# EAGLE schematic boardv2power (EAGLE 6.6.0)

## Sheet 1 of 4: Regulators
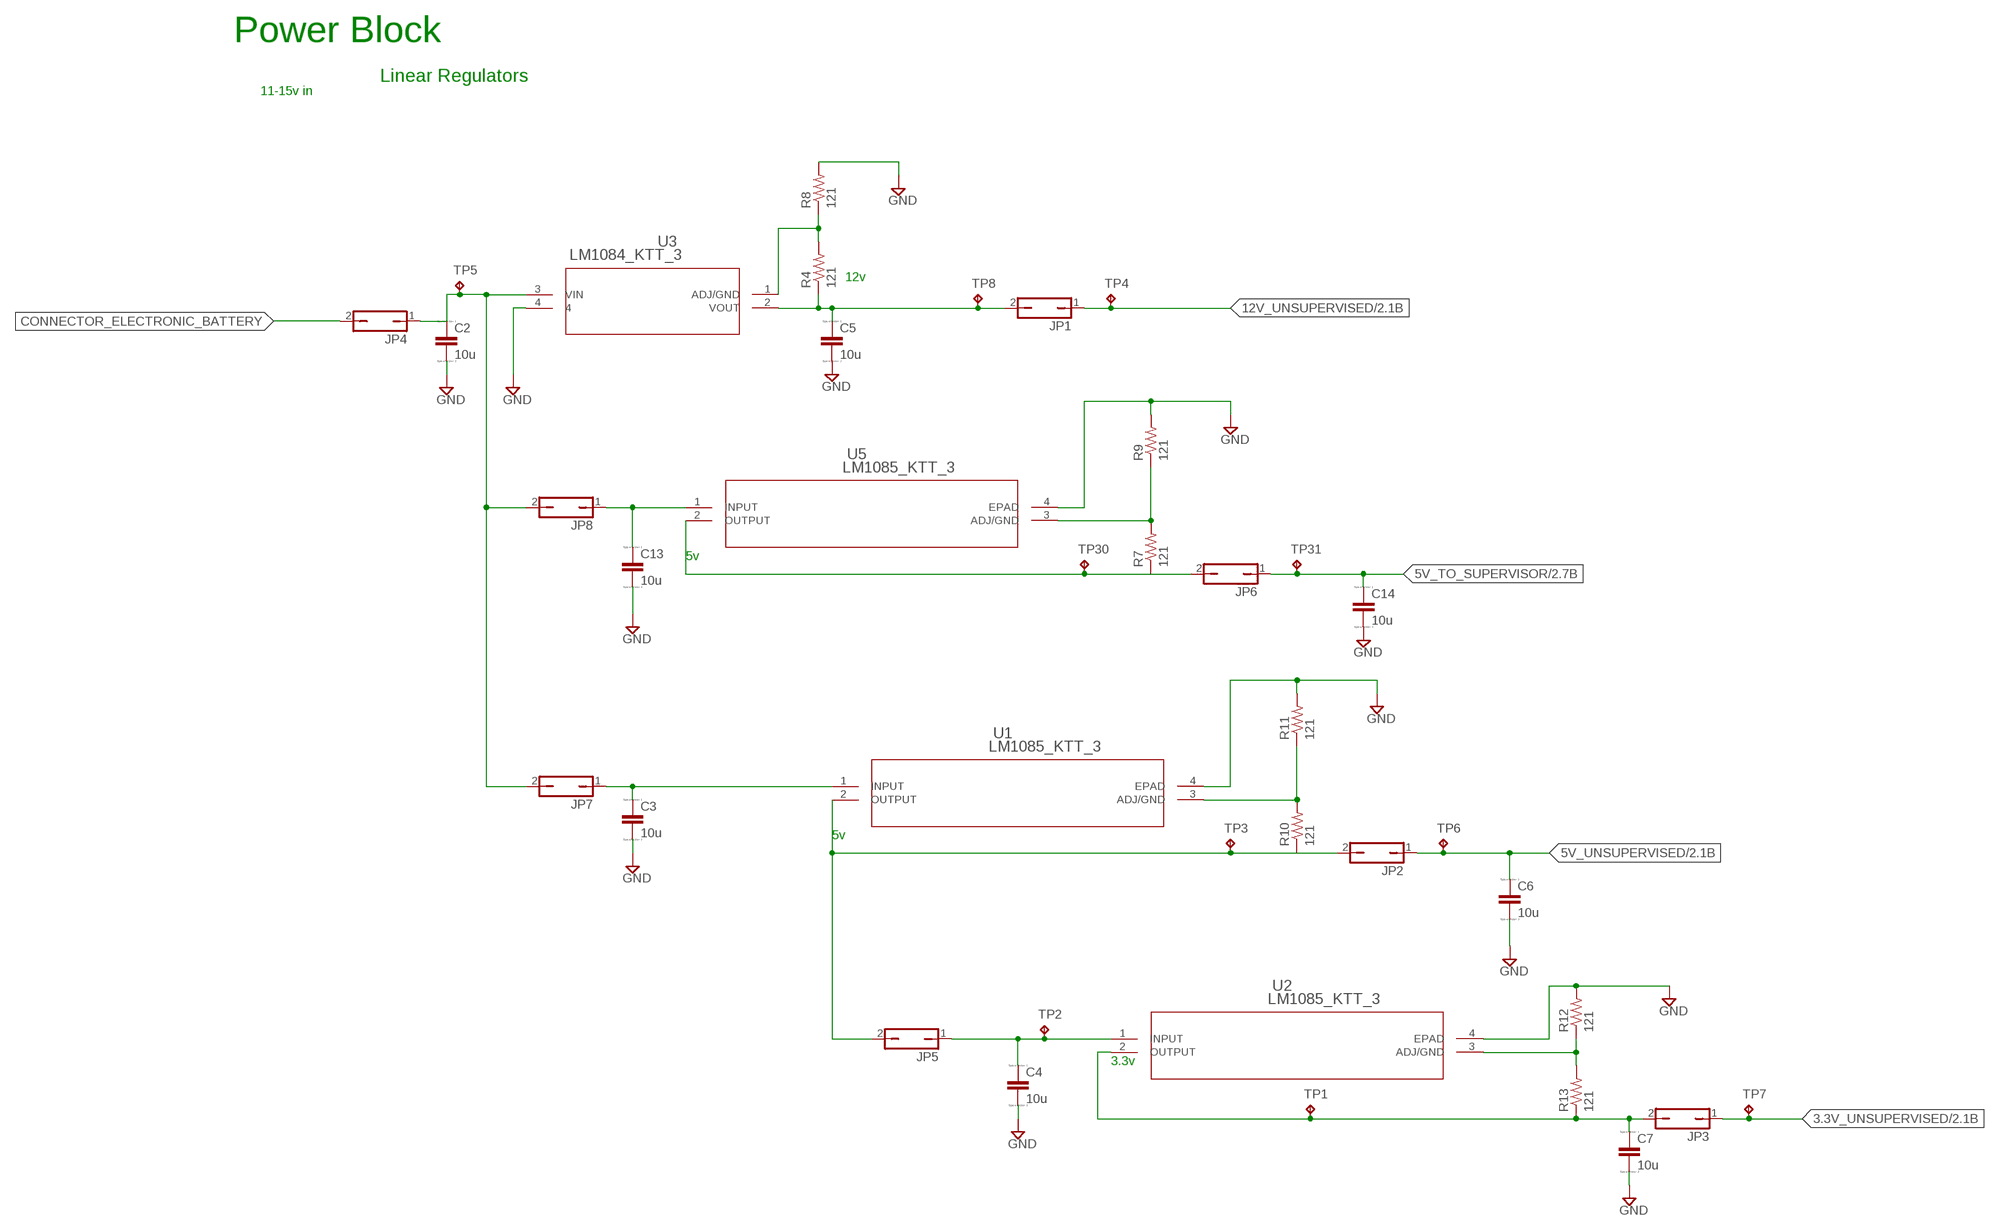
[diagram p0: schematic, sheet 1]

### Parts
C2  10u  CC0603  [C0603]
C3  10u  CC0603  [C0603]
C4  10u  CC0603  [C0603]
C5  10u  CC0603  [C0603]
C6  10u  CC0603  [C0603]
C7  10u  CC0603  [C0603]
C13  10u  CC0603  [C0603]
C14  10u  CC0603  [C0603]
JP1  JP1Q  [JP1]
JP2  JP1Q  [JP1]
JP3  JP1Q  [JP1]
JP4  JP1Q  [JP1]
JP5  JP1Q  [JP1]
JP6  JP1Q  [JP1]
JP7  JP1Q  [JP1]
JP8  JP1Q  [JP1]
R4  121  RESISTOR0603-RES  [0603-RES]
R7  121  RESISTOR0603-RES  [0603-RES]
R8  121  RESISTOR0603-RES  [0603-RES]
R9  121  RESISTOR0603-RES  [0603-RES]
R10  121  RESISTOR0603-RES  [0603-RES]
R11  121  RESISTOR0603-RES  [0603-RES]
R12  121  RESISTOR0603-RES  [0603-RES]
R13  121  RESISTOR0603-RES  [0603-RES]
TP1  TPB1,27  [B1,27]
TP2  TPB1,27  [B1,27]
TP3  TPB1,27  [B1,27]
TP4  TPB1,27  [B1,27]
TP5  TPB1,27  [B1,27]
TP6  TPB1,27  [B1,27]
TP7  TPB1,27  [B1,27]
TP8  TPB1,27  [B1,27]
TP30  TPB1,27  [B1,27]
TP31  TPB1,27  [B1,27]
U1  LM1085_KTT_3  [KTT3]
U2  LM1085_KTT_3  [KTT3]
U3  LM1084_KTT_3  [TS3B]
U5  LM1085_KTT_3  [KTT3]

### Nets
3.3V_UNSUPERVISED: JP3.1 TP7.TP ; also sheet 2
5V_TO_SUPERVISOR: C14.1 JP6.1 TP31.TP ; also sheet 2
5V_UNSUPERVISED: C6.1 JP2.1 TP6.TP ; also sheet 2
12V_UNSUPERVISED: JP1.1 TP4.TP ; also sheet 2
CONNECTOR_ELECTRONIC_BATTERY: JP4.2
GND: C2.2 C3.2 C4.2 C5.2 C6.2 C7.2 C13.2 C14.2 R8.2 R9.2 R11.2 R12.2 U1.4(EPAD) U2.4(EPAD) U3.4 U5.4(EPAD) ; also sheet 2,3,4
N$10: JP6.2 R7.1 TP30.TP U5.2(OUTPUT)
N$11: R4.2 R8.1 U3.1(ADJ/GND)
N$12: C5.1 JP1.2 R4.1 TP8.TP U3.2(VOUT)
N$13: JP2.2 JP5.2 R10.1 TP3.TP U1.2(OUTPUT)
N$14: C7.1 JP3.2 R13.1 TP1.TP U2.2(OUTPUT)
N$15: R10.2 R11.1 U1.3(ADJ/GND)
N$16: R12.1 R13.2 U2.3(ADJ/GND)
N$17: R7.2 R9.1 U5.3(ADJ/GND)
N$19: C3.1 JP7.1 U1.1(INPUT)
N$21: C13.1 JP8.1 U5.1(INPUT)
N$52: C4.1 JP5.1 TP2.TP U2.1(INPUT)
VOLTAGEJMP_+_TO_INPUT_VREG: C2.1 JP4.1 JP7.2 JP8.2 TP5.TP U3.3(VIN)

### Notes on the sheet
- Power Block
- Linear Regulators
- 11-15v in
- 12v
- 5v
- 5v
- 3.3v

## Sheet 2 of 4: Supervisor
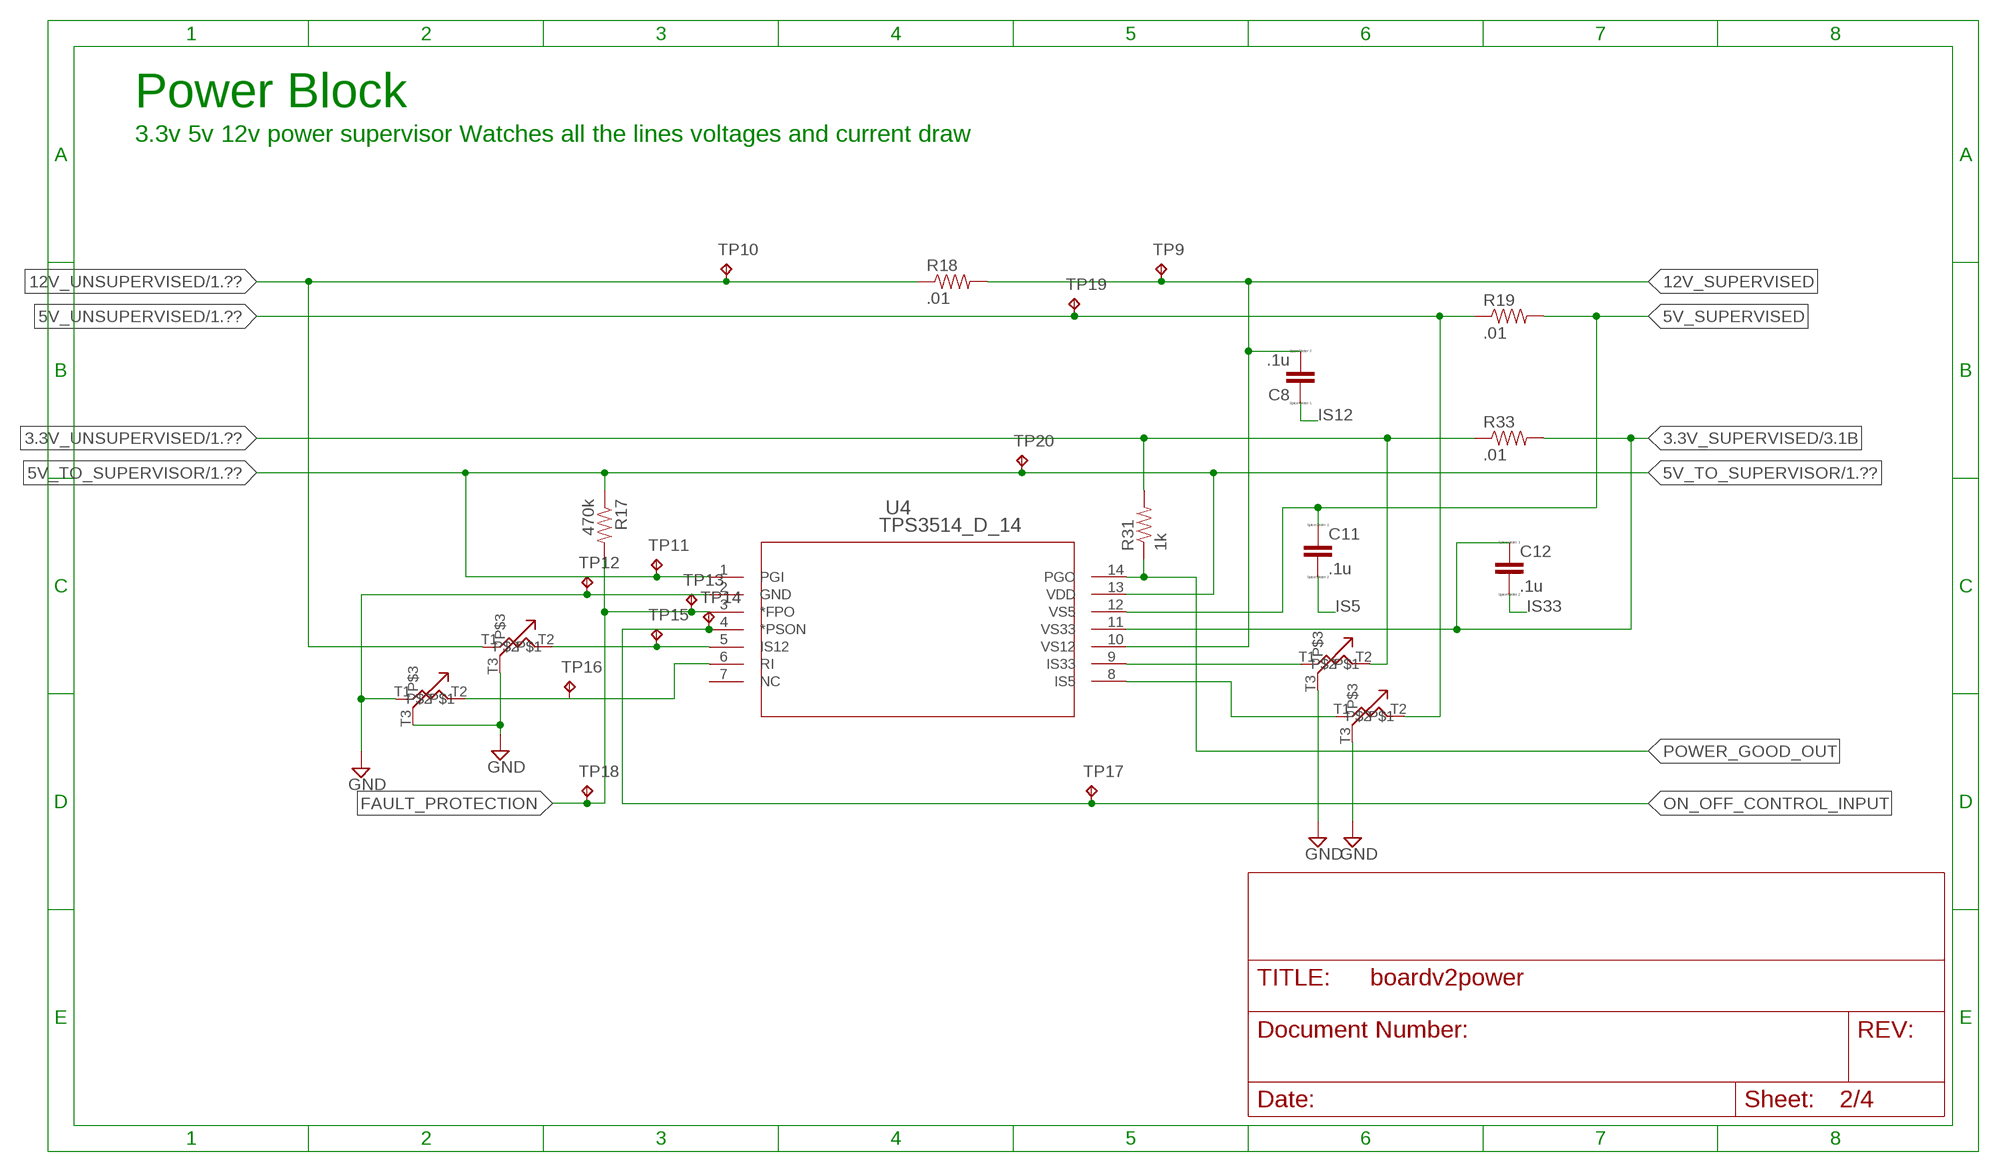
[diagram p1: schematic, sheet 2]

### Parts
C8  .1u  CC0603  [C0603]
C11  .1u  CC0603  [C0603]
C12  .1u  CC0603  [C0603]
R17  470k  RESISTOR0603-RES  [0603-RES]
R18  .01  RESISTOR0603-RES  [0603-RES]
R19  .01  RESISTOR0603-RES  [0603-RES]
R31  1k  RESISTOR0603-RES  [0603-RES]
R33  .01  RESISTOR0603-RES  [0603-RES]
TP9  TPB1,27  [B1,27]
TP10  TPB1,27  [B1,27]
TP11  TPB1,27  [B1,27]
TP12  TPB1,27  [B1,27]
TP13  TPB1,27  [B1,27]
TP14  TPB1,27  [B1,27]
TP15  TPB1,27  [B1,27]
TP16  TPB1,27  [B1,27]
TP17  TPB1,27  [B1,27]
TP18  TPB1,27  [B1,27]
TP19  TPB1,27  [B1,27]
TP20  TPB1,27  [B1,27]
U4  TPS3514_D_14  [D14]
U$7  PVZ3A  [PVZ3A]
U$8  PVZ3A  [PVZ3A]
U$9  PVZ3A  [PVZ3A]
U$17  PVZ3A  [PVZ3A]

### Nets
3.3V_SUPERVISED: C12.1 R33.2 U4.11(VS33) ; also sheet 3,4
3.3V_UNSUPERVISED: R31.2 R33.1 U$8.T2 ; also sheet 1
5V_SUPERVISED: C11.1 R19.2 U4.12(VS5)
5V_TO_SUPERVISOR: R17.1 TP11.TP TP20.TP U4.1(PGI) U4.13(VDD) ; also sheet 1
5V_UNSUPERVISED: R19.1 TP19.TP U$9.T2 ; also sheet 1
12V_SUPERVISED: C8.2 R18.2 TP9.TP U4.10(VS12)
12V_UNSUPERVISED: R18.1 TP10.TP U$7.T1 ; also sheet 1
FAULT_PROTECTION: R17.2 TP13.TP TP18.TP U4.3(*FPO)
GND: TP12.TP U4.2(GND) U$7.T3 U$8.T3 U$9.T3 U$17.T1 U$17.T3 ; also sheet 1,3,4
IS5: C11.2 U4.8(IS5) U$9.T1
IS12: C8.1 TP15.TP U4.5(IS12) U$7.T2
IS33: C12.2 U4.9(IS33) U$8.T1
N$20: TP16.TP U4.6(RI) U$17.T2
ON_OFF_CONTROL_INPUT: TP14.TP TP17.TP U4.4(*PSON)
POWER_GOOD_OUT: R31.1 U4.14(PGO)
Unconnected: U4.7(NC)

### Notes on the sheet
- Power Block
- 3.3v 5v 12v power supervisor Watches all the lines voltages and current draw

## Sheet 3 of 4: Power Monitoring Circuit MCU
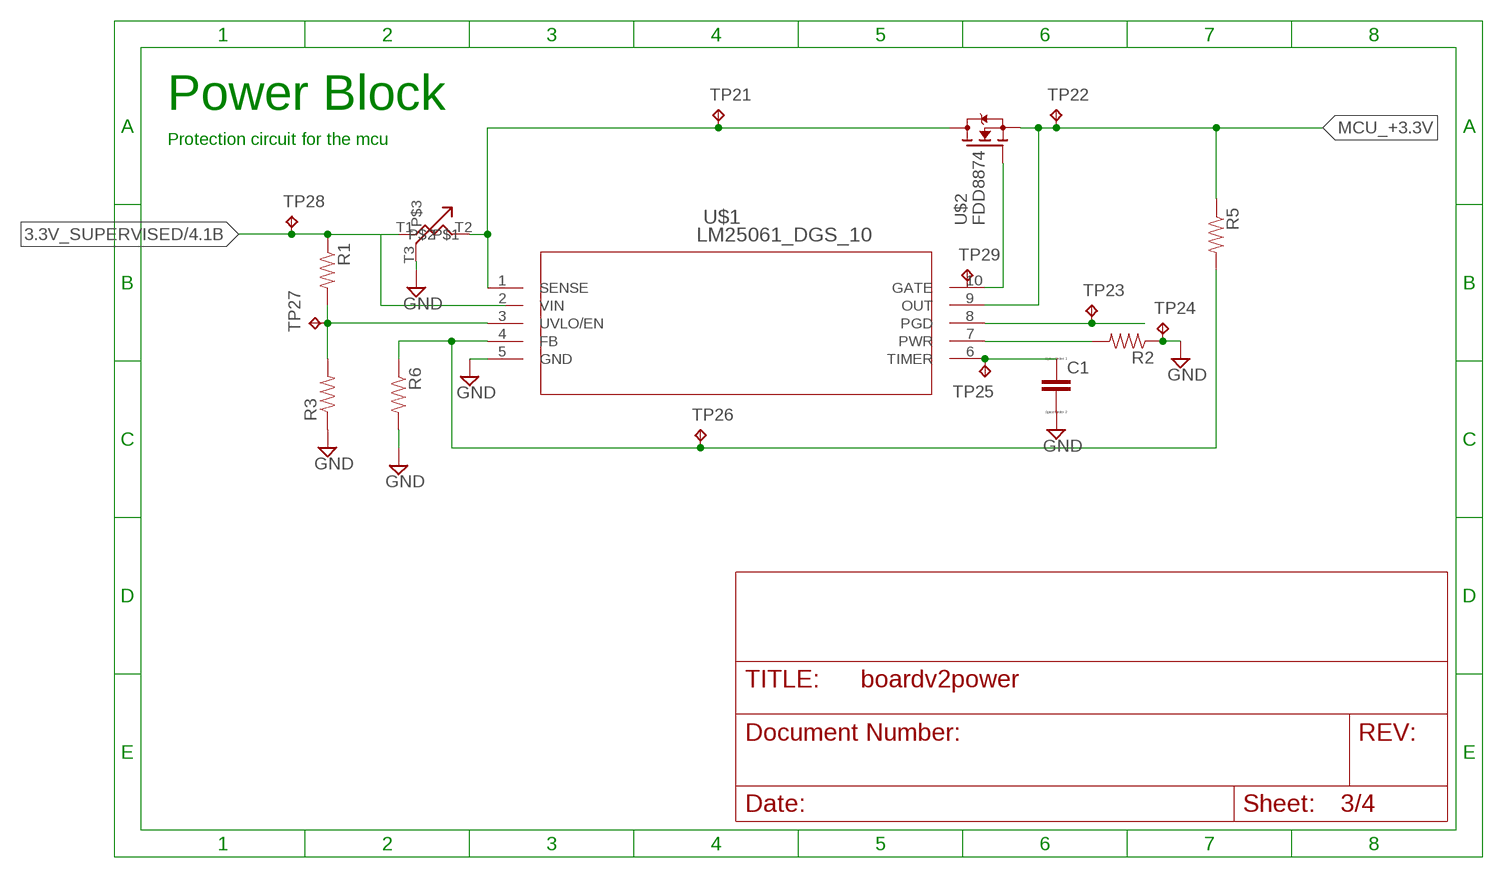
[diagram p2: schematic, sheet 3]

### Parts
C1  CC0603  [C0603]
R1  RESISTOR0603-RES  [0603-RES]
R2  RESISTOR0603-RES  [0603-RES]
R3  RESISTOR0603-RES  [0603-RES]
R5  RESISTOR0603-RES  [0603-RES]
R6  RESISTOR0603-RES  [0603-RES]
TP21  TPB1,27  [B1,27]
TP22  TPB1,27  [B1,27]
TP23  TPB1,27  [B1,27]
TP24  TPB1,27  [B1,27]
TP25  TPB1,27  [B1,27]
TP26  TPB1,27  [B1,27]
TP27  TPB1,27  [B1,27]
TP28  TPB1,27  [B1,27]
TP29  TPB1,27  [B1,27]
U$1  LM25061_DGS_10  [MUB10A]
U$2  FDD8874  [TO252]
U$14  PVG3A  [PVZ3A]

### Nets
3.3V_SUPERVISED: R1.1 TP28.TP U$14.T1 ; also sheet 2,4
GND: C1.2 R2.1 R3.1 R6.2 TP24.TP U$1.5(GND) U$14.T3 ; also sheet 1,2,4
MCU_+3.3V: R5.1 TP22.TP U$1.9(OUT) U$2.4(S)
N$1: C1.1 TP25.TP U$1.6(TIMER)
N$2: R2.2 U$1.7(PWR)
N$3: R1.2 R3.2 TP27.TP U$1.3(UVLO/EN)
N$5: TP21.TP U$1.1(SENSE) U$2.3(D) U$14.T2
N$6: U$1.10(GATE) U$2.1(G)
N$7: R5.2 R6.1 TP26.TP U$1.4(FB)
N$9: TP23.TP U$1.8(PGD)
Unconnected: TP29.TP

### Notes on the sheet
- Power Block
- Protection circuit for the mcu

## Sheet 4 of 4: Power monitoring BM
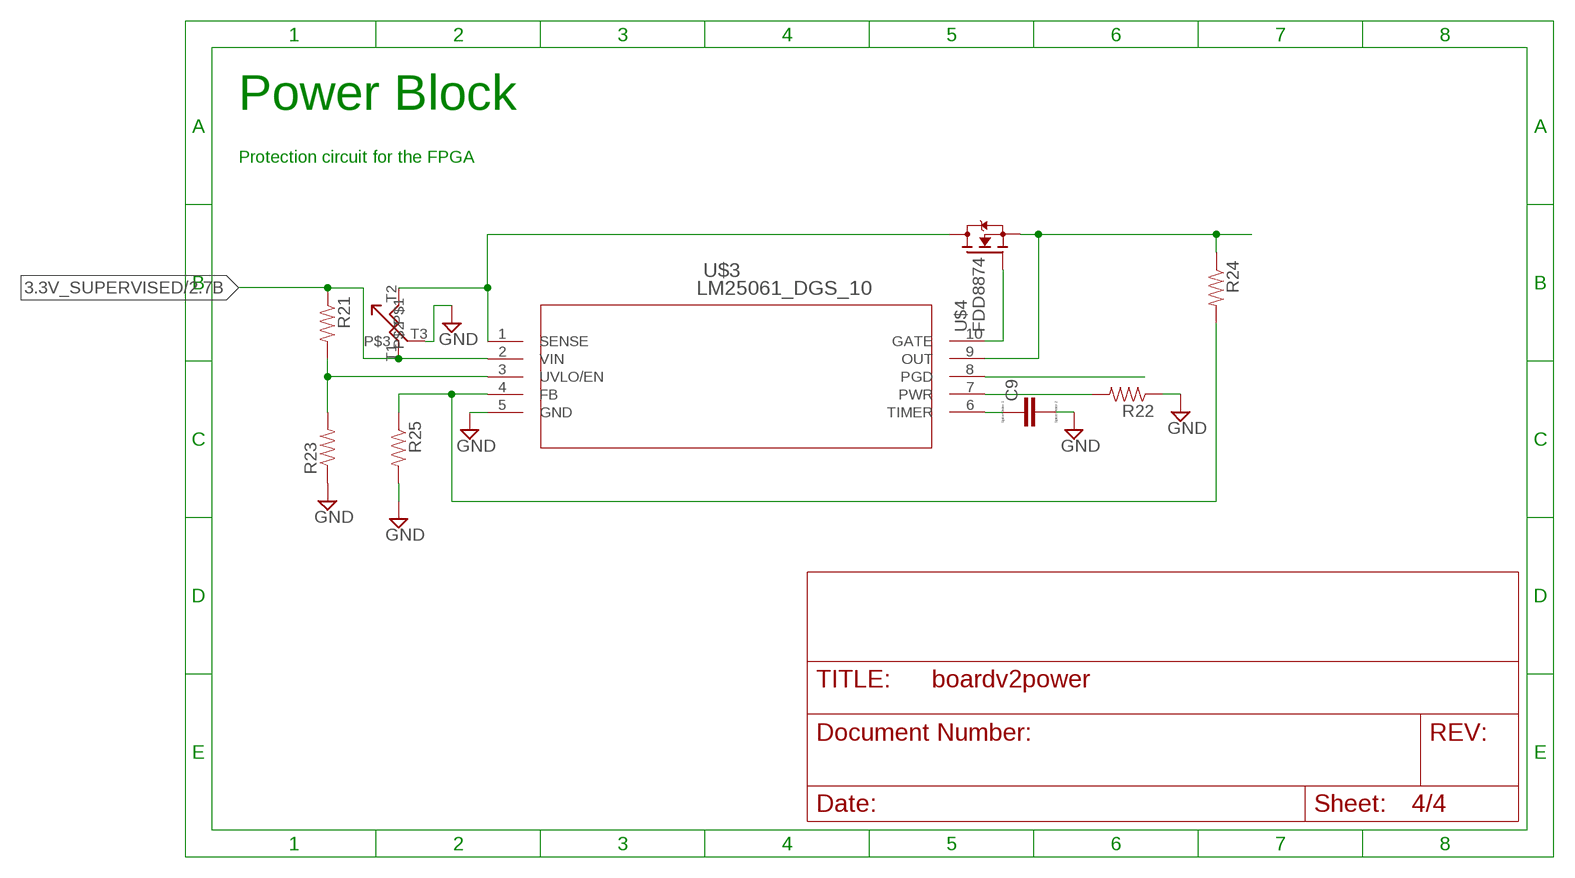
[diagram p3: schematic, sheet 4]

### Parts
C9  CC0603  [C0603]
R21  RESISTOR0603-RES  [0603-RES]
R22  RESISTOR0603-RES  [0603-RES]
R23  RESISTOR0603-RES  [0603-RES]
R24  RESISTOR0603-RES  [0603-RES]
R25  RESISTOR0603-RES  [0603-RES]
U$3  LM25061_DGS_10  [MUB10A]
U$4  FDD8874  [TO252]
U$16  PVG3A  [PVZ3A]

### Nets
3.3V_SUPERVISED: R21.1 U$3.2(VIN) U$16.T1 ; also sheet 2,3
GND: C9.2 R22.1 R23.1 R25.2 U$3.5(GND) U$16.T3 ; also sheet 1,2,3
N$30: C9.1 U$3.6(TIMER)
N$31: R22.2 U$3.7(PWR)
N$32: R21.2 R23.2 U$3.3(UVLO/EN)
N$33: U$3.1(SENSE) U$4.3(D) U$16.T2
N$35: U$3.10(GATE) U$4.1(G)
N$36: R24.2 R25.1 U$3.4(FB)
N$37: R24.1 U$3.9(OUT) U$4.4(S)
N$38: U$3.8(PGD)

### Notes on the sheet
- Power Block
- Protection circuit for the FPGA

## Power pins joined to a net without a drawn wire
VIN: U$1.2(VIN)

## Library data of the parts
C1-C9 C11-C14 = eagle-ltspice:C: CAPACITOR, European symbol; SPICEMODEL: NONE; SPICEPREFIX: C
JP1-JP8 = jumper:JP1Q: JUMPER
R1-R13 R17-R19 R21-R25 R31 R33 = SparkFun-Passives:RESISTOR: Resistor Basic schematic elements and footprints for 0603, 1206, and PTH resistors.
TP1-TP31 = testpad:TP: Test pad
U1 U2 U5 = shit:LM1085_KTT_3; MANUFACTURER_PART_NUMBER: lm1085_ktt_3; VENDOR: Texas Instruments
U3 = shit:LM1084_KTT_3; BASE_PN: LM1084; COMP: TypeLDO; LIBRARY: ReferenceLM1084IS; PARTNUMBER: LM1084IS-33; PIN: Count3; SYMBOL: NameLM1084IS-33; TYPE: LM1084IS-3.3; VENDOR: NationalSemiconductor; VERSION: 1
U4 = shit:TPS3514_D_14; DATASHEETURL: http://www.ti.com/lit/gpn/TPS3514; DESCRIPTION: 3 Ch Supervisor with Over Current Detect for Switchmode Power Supplies; FAMILY_NAME: SUPERVISOR AND RESET IC; GENERIC_PART_NUMBER: TPS3514; INDUSTRY_STD_PKG_TYPE: SOIC; MANUFACTURER: Texas Instruments; MANUFACTURER_PART_NUMBER: tps3514_d_14; PACKAGE_DESIGNATOR: D; PIN_COUNT: 14; VENDOR: Texas Instruments
U$1 U$3 = shit:LM25061_DGS_10; MANUFACTURER_PART_NUMBER: lm25061pmm-1nopb; VENDOR: National
U$2 U$4 = transistor-fet:FDD8874
U$7-U$9 = shit:PVZ3A; DIGI: 987-1549-ND
U$14 U$16 = shit:PVG3A; BITECH: 84WR10LF
U$17 = shit:PVZ3A; DIGI: 987-1154-ND